# Altium schematic sheet Main.SchDoc
size 420 x 297 mm; CheckedBy: Bao Bui Q.; Engineer: Hung Nguyen D.; Revision: 1.0.0; SheetNumber: 1; SheetTotal: 1
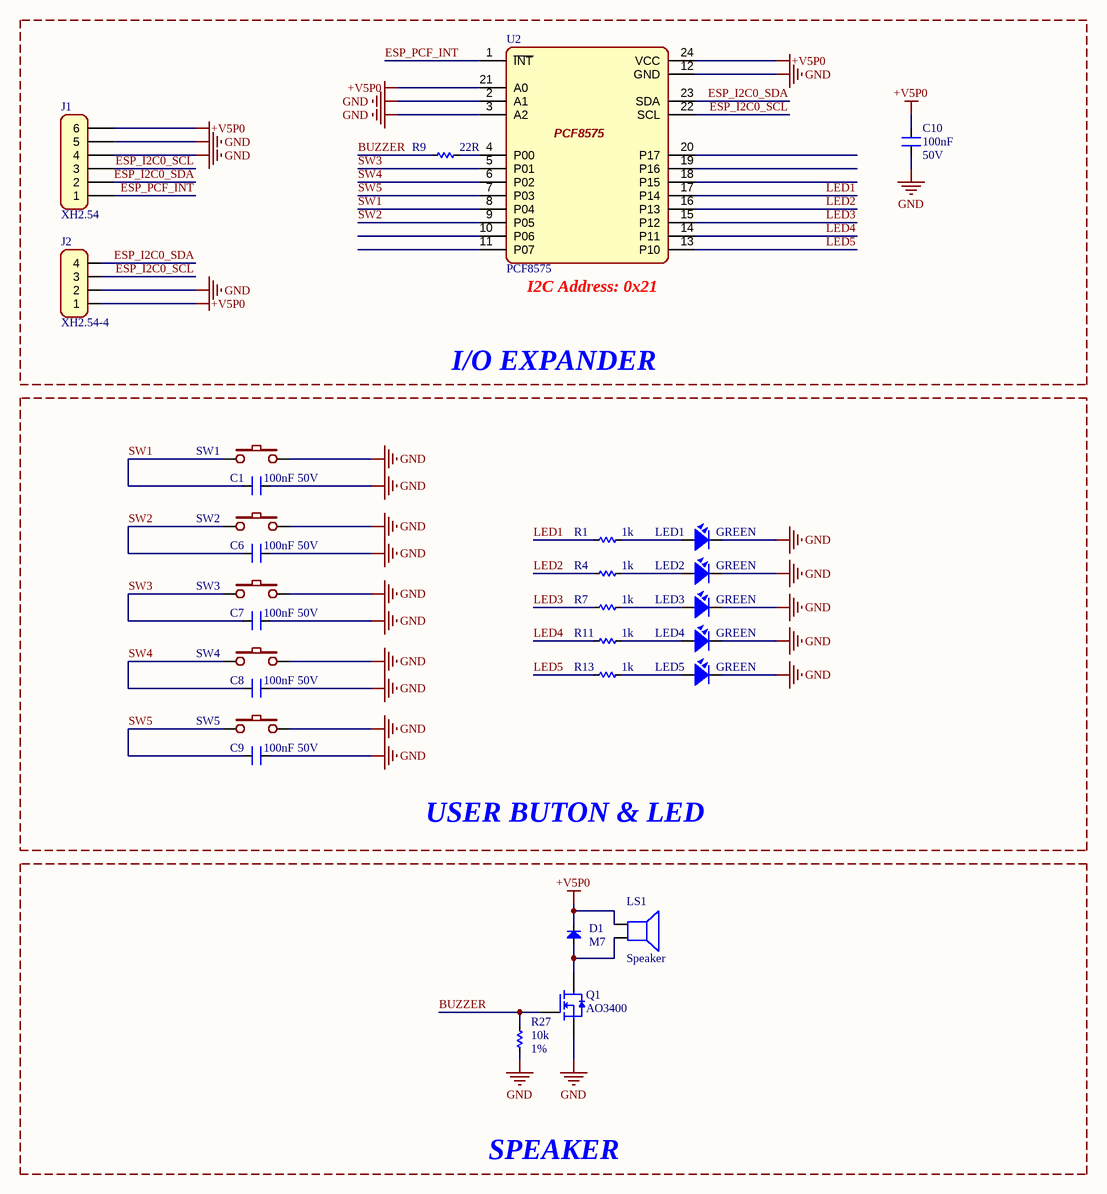
[diagram p0: Main.SchDoc]

## Parts
C1  Rating: 50V  [CAP_SMD_0805]  (hidden comment: 100nF)
C6  Rating: 50V  [CAP_SMD_0805]  (hidden comment: 100nF)
C7  Rating: 50V  [CAP_SMD_0805]  (hidden comment: 100nF)
C8  Rating: 50V  [CAP_SMD_0805]  (hidden comment: 100nF)
C9  Rating: 50V  [CAP_SMD_0805]  (hidden comment: 100nF)
C10  Rating: 50V  [CAP_SMD_0805]  (hidden comment: 100nF)
D1  M7  [DIO-SMD-A]
J1  XH2.54  [XH2.54-6P-TH]
J2  XH2.54-4  [Header4]
LED1  GREEN  [LED-3MM-GREEN]
LED2  GREEN  [LED-3MM-GREEN]
LED3  GREEN  [LED-3MM-GREEN]
LED4  GREEN  [LED-3MM-GREEN]
LED5  GREEN  [LED-3MM-GREEN]
LS1  Speaker  [SPEAKER]
Q1  AO3400  [SOT23-123]
R1  1k  [RES_SMD_0805]
R4  1k  [RES_SMD_0805]
R7  1k  [RES_SMD_0805]
R9  22R  [RES_SMD_0805]
R11  1k  [RES_SMD_0805]
R13  1k  [RES_SMD_0805]
R27  Tolerance: 1%  [RES_SMD_0805]  (hidden comment: 10k)
SW1  SW2  [SW-6X6MM]  (value not drawn)
SW2  SW2  [SW-6X6MM]  (value not drawn)
SW3  SW2  [SW-6X6MM]  (value not drawn)
SW4  SW2  [SW-6X6MM]  (value not drawn)
SW5  SW2  [SW-6X6MM]  (value not drawn)
U2  PCF8575  [SSOP-24-208mil]

## Blocks framed on the sheet
I/O EXPANDER: C10 J1 J2 R9 U2
USER BUTON & LED: C1 C6-C9 LED1-LED5 R1 R4 R7 R11 R13 SW1-SW5
SPEAKER: D1 LS1 Q1 R27

## Nets
+V5P0: C10.1 D1.2(K) J1.6 J2.1 LS1.1 U2.21(A0) U2.24(VCC)
GND: C1.2 C6.2 C7.2 C8.2 C9.2 C10.2 J1.4 J1.5 J2.2 LED1.2 LED2.2 LED3.2 LED4.2 LED5.2 Q1.2 R27.2 SW1.2 SW2.2 SW3.2 SW4.2 SW5.2 U2.2(A1) U2.3(A2) U2.12(GND)
BUZZER: Q1.1 R9.2 R27.1
ESP_I2C0_SCL: J1.3 J2.3 U2.22(SCL)
ESP_I2C0_SDA: J1.2 J2.4 U2.23(SDA)
ESP_PCF_INT: J1.1 U2.1(~{INT})
LED1: R1.2 U2.17(P14)
LED2: R4.2 U2.16(P13)
LED3: R7.2 U2.15(P12)
LED4: R11.2 U2.14(P11)
LED5: R13.2 U2.13(P10)
SW1: C1.1 SW1.1 U2.8(P04)
SW2: C6.1 SW2.1 U2.9(P05)
SW3: C7.1 SW3.1 U2.5(P01)
SW4: C8.1 SW4.1 U2.6(P02)
SW5: C9.1 SW5.1 U2.7(P03)
NetD1_1: D1.1(A) LS1.2 Q1.3
NetLED1_1: LED1.1 R1.1
NetLED2_1: LED2.1 R4.1
NetLED3_1: LED3.1 R7.1
NetLED4_1: LED4.1 R11.1
NetLED5_1: LED5.1 R13.1
NetR9_1: R9.1 U2.4(P00)

Not connected (* = marked no-connect by the designer): U2 10(P06) 11(P07) 18(P15) 19(P16) 20(P17)

## Notes on the sheet
- (near U2) I2C Address: 0x21
- Project:
- Sheet title:
- Sheet
- of
- Design by:
- Document No:
- Size:
- A3
- Checked by:
- Revision:
- Date:

## Library data of the parts
C1 C6-C10 = CN: PN: *; LCSC: *; Value: 100nF
D1 = Diode SMD: Default Diode; LCSC: *; PN: *; Value: M7
J1 = Header6: ComponentLink1 Description: Manufacturer; ComponentLink2 Description: Datasheet; ComponentLink1URL: http://www.we-online.com; ComponentLink2URL: http://katalog.we-online.de/em/datasheet/6130xx143121.pdf; PN: *; LCSC: *; Value: XH2.54
J2 = Header4: Header IDC, 4 x 1 Pin Vertical 2.54mm Pitch (Non-Boxed, Male); ComponentLink1 Description: Manufacturer; ComponentLink2 Description: Datasheet; PN: *; LCSC: *; ComponentLink1URL: http://www.we-online.com; ComponentLink2URL: http://katalog.we-online.de/em/datasheet/6130xx143121.pdf; Value: XH2.54-4
LED1-LED5 = LED SMD: PN: *; LCSC: *; Value: GREEN
LS1 = Speaker: Loudspeaker; Published: 24-Mar-1999; LatestRevisionDate: 17-Jul-2002; LatestRevisionNote: Re-released for DXP Platform.; PackageReference: PIN2; Publisher: Altium Limited
Q1 = FET-N: PN: *; LCSC: *; Value: AO3400
R1 R4 R7 R9 R11 R13 = Res-SMD: Resistor; Tolerance: 1%; PN: *; LCSC: *
  R1 R4 R7 R11 R13: Value: 1k
  R9: Value: 22R
R27 = Res-SMD: Resistor; PN: *; LCSC: *; Value: 10k
SW1-SW5 = SW2: Switch button 2 pin; PN: B3U-3000P; LCSC: C963349; Value: SW2
U2 = PCF8575: -40℃~+85℃ 10uA 16 2.5V~5.5V 25mA 300uA 400kHz 8 Cascading and address extension、Built-in LED driver I2C Interrupt Output SSOP-24-208mil I/O Expanders ROHS; PN: PCF8575TS/1,118; LCSC: C12251; Value: PCF8575